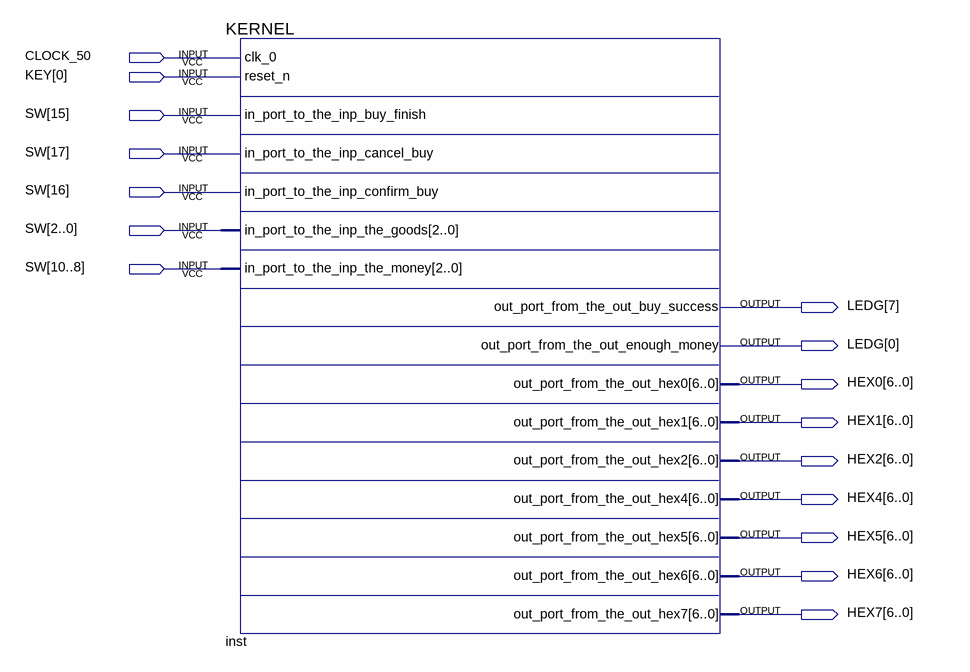
[diagram p0: schematic sheet]
// Quartus schematic sell_soft.bdf as structural Verilog: 1 symbols, 16 pins
module sell_soft (
  input  CLOCK_50,
  input  [0:0] KEY,
  input  [17:0] SW,
  output [7:0] LEDG,
  output [6:0] HEX0,
  output [6:0] HEX1,
  output [6:0] HEX2,
  output [6:0] HEX4,
  output [6:0] HEX5,
  output [6:0] HEX6,
  output [6:0] HEX7
);

  KERNEL inst (
    .clk_0(CLOCK_50), .reset_n(KEY[0]), .in_port_to_the_inp_buy_finish(SW[15]),
    .in_port_to_the_inp_cancel_buy(SW[17]), .in_port_to_the_inp_confirm_buy(SW[16]),
    .in_port_to_the_inp_the_goods(SW[2:0]), .in_port_to_the_inp_the_money(SW[10:8]),
    .out_port_from_the_out_buy_success(LEDG[7]), .out_port_from_the_out_enough_money(LEDG[0]),
    .out_port_from_the_out_hex0(HEX0), .out_port_from_the_out_hex1(HEX1), .out_port_from_the_out_hex2(HEX2),
    .out_port_from_the_out_hex4(HEX4), .out_port_from_the_out_hex5(HEX5), .out_port_from_the_out_hex6(HEX6),
    .out_port_from_the_out_hex7(HEX7));
endmodule
